# EAGLE design sound-detector (EAGLE 9.1.0)
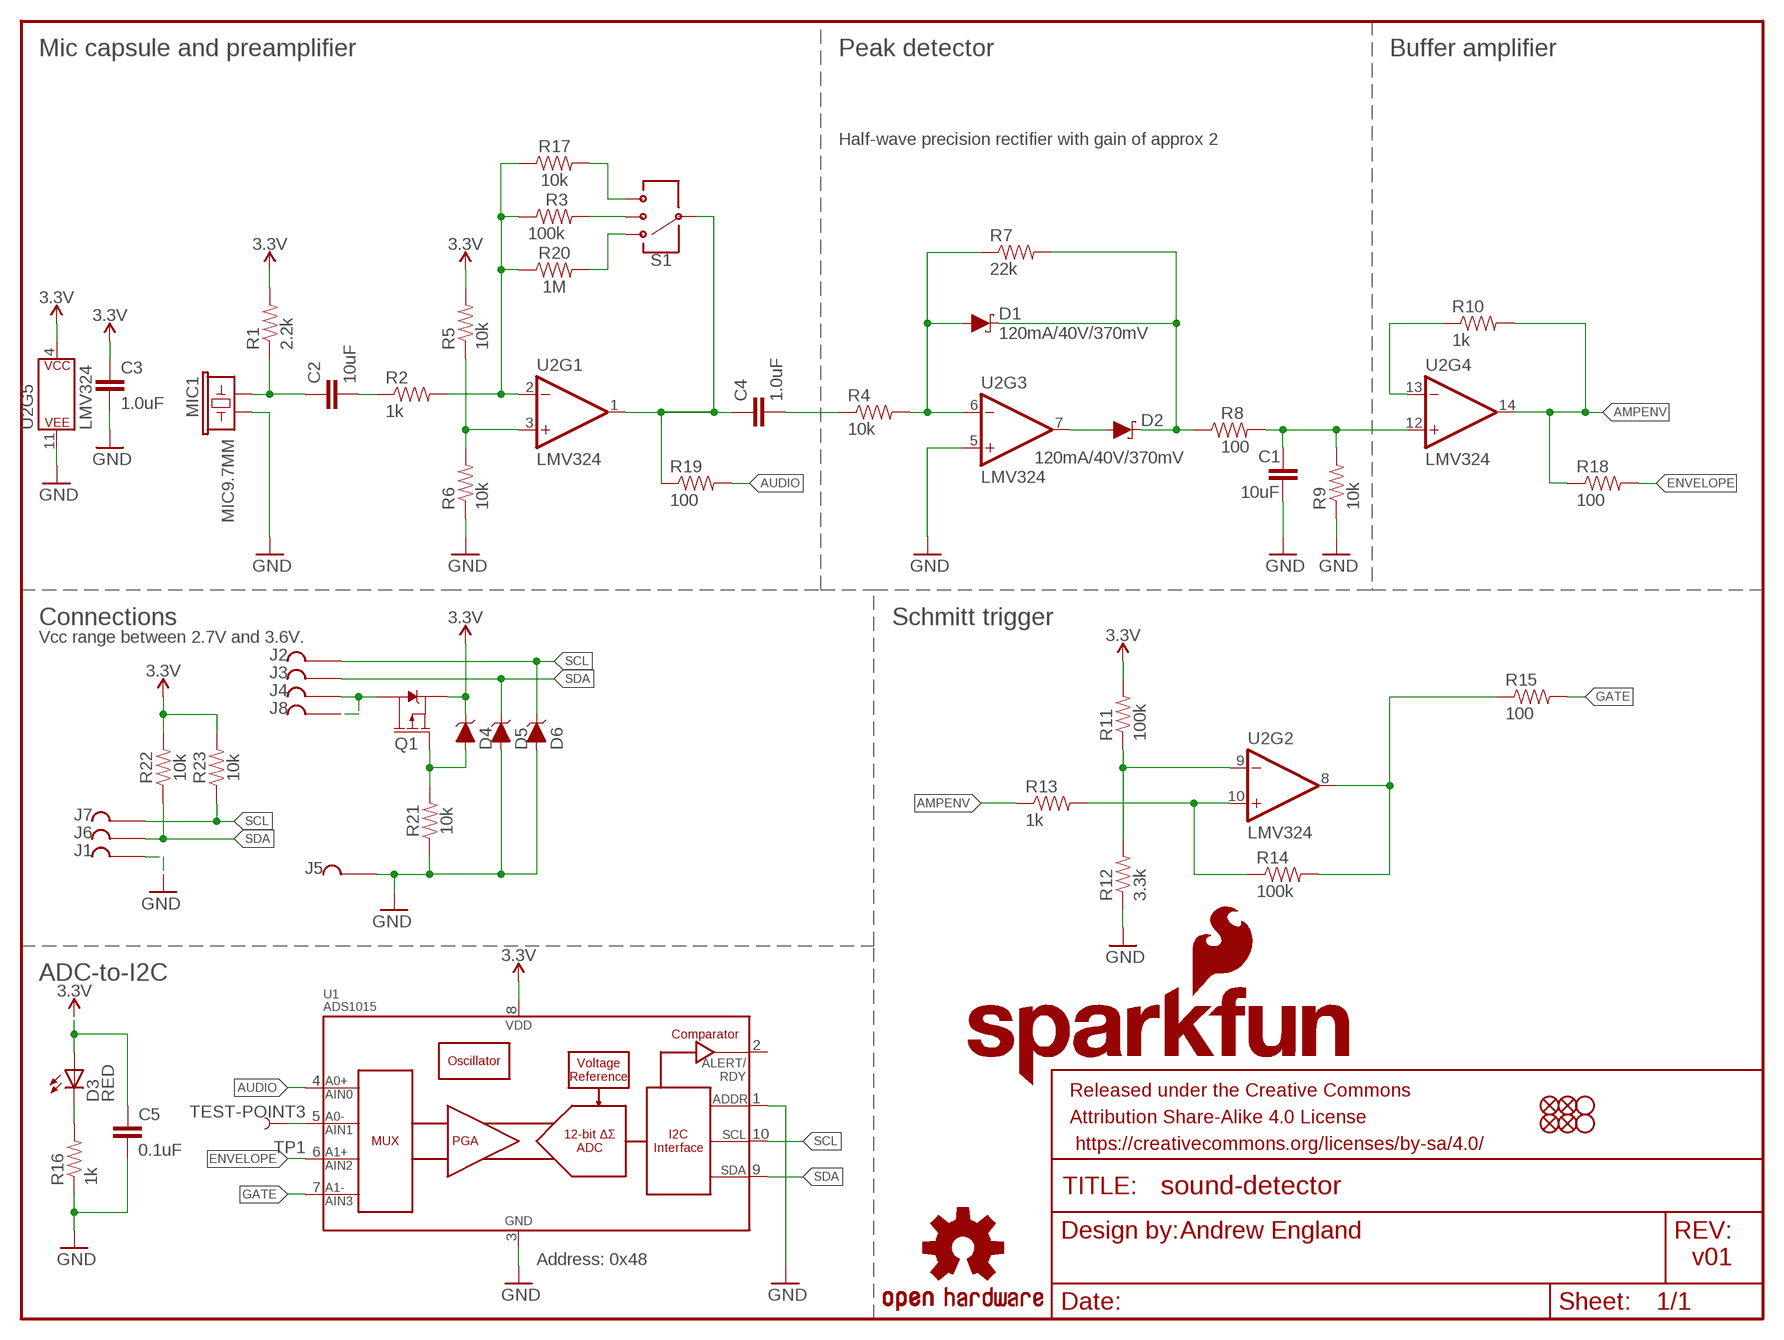
[diagram p0: schematic, sheet 1]

## Parts
C1  10uF  10UF-6.3V-20%(1206)  [1206@1]
C2  10uF  10UF-6.3V-20%(1206)  [1206@1]
C3  1.0uF  1.0UF-0603-16V-10%  [0603]
C4  1.0uF  1.0UF-0603-16V-10%  [0603]
C5  0.1uF  0.1UF-0603-25V-(+80/-20%)  [0603]
D1  120mA/40V/370mV  DIODE-SCHOTTKY-RB751S40  [SOD-523]
D2  120mA/40V/370mV  DIODE-SCHOTTKY-RB751S40  [SOD-523]
D3  RED  LED-RED0603  [LED-0603]
D4  3.6V  DIODE-ZENER-BZT52C3V6S  [SOD-323]
D5  3.6V  DIODE-ZENER-BZT52C3V6S  [SOD-323]
D6  3.6V  DIODE-ZENER-BZT52C3V6S  [SOD-323]
FID1  FIDUCIAL1X2  [FIDUCIAL-1X2]
FID2  FIDUCIAL1X2  [FIDUCIAL-1X2]
FID3  FIDUCIAL1X2  [FIDUCIAL-1X2]
FID4  FIDUCIAL1X2  [FIDUCIAL-1X2]
FRAME1  FRAME-LETTER  [CREATIVE_COMMONS]
H1  STAND-OFFTIGHT  [STAND-OFF-TIGHT]
H2  STAND-OFFTIGHT  [STAND-OFF-TIGHT]
J1  GATORGATOR_MINI  [GATOR_MINI]
J2  GATORGATOR_MINI  [GATOR_MINI]
J3  GATORGATOR_MINI  [GATOR_MINI]
J4  GATORGATOR_MINI  [GATOR_MINI]
J5  GATORGATOR_MINI  [GATOR_MINI]
J6  GATORGATOR_MINI  [GATOR_MINI]
J7  GATORGATOR_MINI  [GATOR_MINI]
J8  GATORGATOR_MINI  [GATOR_MINI]
LOGO1  OSHW-LOGOS  [OSHW-LOGO-S]
LOGO2  SFE_LOGO_NAME_FLAME.2_INCH  [SFE_LOGO_NAME_FLAME_.2]
LOGO3  SFE_LOGO_FLAME.2_INCH  [SFE_LOGO_FLAME_.2]
MIC1  MIC9.7MM  [MIC-9.7MM]
Q1  2.5A/30V/105mΩ  MOSFET_PCH-DMG2307L  [SOT23-3]
R1  2.2k  2.2KOHM-0603-1/10W-1%  [0603]
R2  1k  1KOHM-0603-1/10W-1%  [0603]
R3  100k  100KOHM-0603-1/10W-1%  [0603]
R4  10k  10KOHM-0603-1/10W-1%  [0603]
R5  10k  10KOHM-0603-1/10W-1%  [0603]
R6  10k  10KOHM-0603-1/10W-1%  [0603]
R7  22k  22KOHM-0603-1/10W-1%  [0603]
R8  100  100OHM-0603-1/10W-1%  [0603]
R9  10k  10KOHM-0603-1/10W-1%  [0603]
R10  1k  1KOHM-0603-1/10W-1%  [0603]
R11  100k  100KOHM-0603-1/10W-1%  [0603]
R12  3.3k  3.3KOHM-0603-1/10W-1%  [0603]
R13  1k  1KOHM-0603-1/10W-1%  [0603]
R14  100k  100KOHM-0603-1/10W-1%  [0603]
R15  100  100OHM-0603-1/10W-1%  [0603]
R16  1k  1KOHM-0603-1/10W-1%  [0603]
R17  10k  10KOHM-0603-1/10W-1%  [0603]
R18  100  100OHM-0603-1/10W-1%  [0603]
R19  100  100OHM-0603-1/10W-1%  [0603]
R20  1M  1MOHM-0603-1/4W-5%  [0603]
R21  10k  10KOHM-0603-1/10W-1%  [0603]
R22  10k  10KOHM-0603-1/10W-1%  [0603]
R23  10k  10KOHM-0603-1/10W-1%  [0603]
S1  SWITCH-SP3T-SMD  [SWITCH_SP3T_SMD]
TP1  TEST-POINT3  [PAD.03X.03]
U1  ADS1015  [MSOP10]
U2  LMV324  [SO14]

## Nets
3.3V: C3.1 C5.1 D3.A D4.C Q1.2(S) R1.2 R5.2 R11.2 R22.2 R23.2 U1.8(VDD) U2.4(P$V+)
AMPENV: R10.2 R13.1 R18.1 U2.14(OUT)
AUDIO: R19.2 U1.4(AIN0)
ENVELOPE: R18.2 U1.6(AIN2)
GATE: R15.2 U1.7(AIN3)
GND: C1.2 C3.2 C5.2 D5.A D6.A J1.P$2 J5.P$2 MIC1.2 R6.1 R9.1 R12.1 R16.1 R21.1 U1.1(ADDR) U1.3(VSS) U2.5(+IN) U2.11(P$V-)
N$: C4.1 R19.1 S1.3 U2.1(OUT)
N$1: C2.1 MIC1.1 R1.1
N$2: R5.1 R6.2 U2.3(+IN)
N$3: D3.C R16.2
N$4: R2.2 R3.1 R17.1 R20.1 U2.2(-IN)
N$5: C2.2 R2.1
N$6: C4.2 R4.1
N$7: D1.A R4.2 R7.1 U2.6(-IN)
N$8: D2.A U2.7(OUT)
N$9: D1.C D2.C R7.2 R8.1
N$10: C1.1 R8.2 R9.2 U2.12(+IN)
N$11: R10.1 U2.13(-IN)
N$12: TP1.P$1 U1.5(AIN1)
N$13: R17.2 S1.4
N$14: R3.2 S1.2
N$15: R11.1 R12.2 U2.9(-IN)
N$16: R13.2 R14.1 U2.10(+IN)
N$17: R14.2 R15.1 U2.8(OUT)
N$18: R20.2 S1.1
N$19: J4.P$2 J8.P$2 Q1.3(D)
N$20: D4.A Q1.1(G) R21.2
SCL: D6.C J2.P$2 J7.P$2 R23.1 U1.10(SCL)
SDA: D5.C J3.P$2 J6.P$2 R22.1 U1.9(SDA)
Unconnected: U1.2(ALERT/RDY)

## Notes on the sheet
- Mic capsule and preamplifier | Peak detector | Buffer amplifier
- Half-wave precision rectifier with gain of approx 2
- Connections | Schmitt trigger
- Vcc range between 2.7V and 3.6V.
- ADC-to-I2C
- Andrew England
- Address: 0x48 | v01

## Library data of the parts
C1 C2 = SparkFun-Capacitors:10UF-6.3V-20%(1206): Ceramic CAP-10057; PROD_ID: CAP-10057
C3 C4 = SparkFun-Capacitors:1.0UF: 1µF ceramic capacitors A capacitor is a passive two-terminal electrical component used to store electrical energy temporarily in an electric field.; PROD_ID: CAP-00868
C5 = SparkFun-Capacitors:0.1UF: 0.1µF ceramic capacitors A capacitor is a passive two-terminal electrical component used to store electrical energy temporarily in an electric field.; PROD_ID: CAP-00810
D1 D2 = SparkFun-DiscreteSemi:DIODE-SCHOTTKY: Schottky diode A Schottky diode is a semiconductor diode which has a low forward voltage drop and a very fast switching action.; PROD_ID: DIO-11018
D3 = SparkFun-LED:LED-RED: Assorted Red LEDs LilyPad 1206- DIO-09912 1206- DIO-00809 0603- DIO-00819; PROD_ID: DIO-00819
D4-D6 = SparkFun-DiscreteSemi:DIODE-ZENER: Zener Diode A Zener diode allows current to flow from its anode to its cathode like a normal semiconductor diode, but it also permits current to flow in the reverse direction when its "Zener voltage" is reached. - WIkipedia; PROD_ID: DIO-08199
FID1-FID4 = SparkFun-Aesthetics:FIDUCIAL: Fiducial Alignment Points Point-of-reference for pick-and-place machines and other optical instruments.
FRAME1 = SparkFun-Aesthetics:FRAME-LETTER: Schematic Frame - Letter Standard 8.5x11 US Letter frame
H1 H2 = SparkFun-Hardware:STAND-OFF: Stand Off Drill holes for mechanically mounting via screws, standoffs, etc. Note: Use the keepout ring to avoid running the screw head into surrounding components. Variant Overviews STAND-OFF - Mechanical footprint for a #4 phillips button head screw. STAND-OFF-TIGHT - Mechanical footprint for a #4 phillips button head screw, Example SparkFun Products Screw - Phillips Head (1/4", 4-40, 10 pack) <https://www.sparkfun.com/products/10453> (PRT-10453) Screw - Phillips Head (1/2", 4-40, 10 pack) <https://www.sparkfun.com/products/10452> (PRT-10452) Screw - Phillips Head (3/4", 4-40, 10 pack) <https://www.sparkfun.com/products/10451> (PRT-10451) Screw - Phillips Head (1", 4-40, 10 pack) <https://www.sparkfun.com/products/10450> (PRT-10450)
J1-J8 = SparkFun-Connectors:GATOR
LOGO1 = SparkFun-Aesthetics:OSHW-LOGO: Open-Source Hardware (OSHW) Logo This logo indicates the piece of hardware it is found on incorporates a OSHW license and/or adheres to the definition of open source hardware found here: http://freedomdefined.org/OSHW
LOGO2 = SparkFun-Aesthetics:SFE_LOGO_NAME_FLAME: SparkFun Font Logo w/ Flame This is the SparkFun full logo. The logo on the schematic will always be the same size; the package variant is the height of the flame part of the logo. Default layer for the logo on the board is tSilk.
LOGO3 = SparkFun-Aesthetics:SFE_LOGO_FLAME: SparkFun Flame Logo This is the SparkFun flame logo. The logo on the schematic will always be the same size; the package variant is the height of the flame. Default layer for the logo on the board is tSilk.
MIC1 = SparkFun-Sensors:MIC: Omni-directional electret microphone. 9.7mm standard diameter.; PROD_ID: COMP-08856
Q1 = SparkFun-DiscreteSemi:MOSFET_PCH: P-channel MOSFETs Voltage controlled devices that allow control of high current outputs. SparkFun Products: SparkFun ESP32 Thing <https://www.sparkfun.com/products/13907> SparkFun ESP8266 Thing <https://www.sparkfun.com/products/13231>; PROD_ID: TRANS-11308
R1 = SparkFun-Resistors:2.2KOHM: 2.2kΩ resistor A resistor is a passive two-terminal electrical component that implements electrical resistance as a circuit element. Resistors act to reduce current flow, and, at the same time, act to lower voltage levels within circuits. - Wikipedia; PROD_ID: RES-08272
R2 R10 R13 R16 = SparkFun-Resistors:1KOHM: 1kΩ resistor A resistor is a passive two-terminal electrical component that implements electrical resistance as a circuit element. Resistors act to reduce current flow, and, at the same time, act to lower voltage levels within circuits. - Wikipedia; PROD_ID: RES-07856
R3 R11 R14 = SparkFun-Resistors:100KOHM: 100kΩ resistor A resistor is a passive two-terminal electrical component that implements electrical resistance as a circuit element. Resistors act to reduce current flow, and, at the same time, act to lower voltage levels within circuits. - Wikipedia; PROD_ID: RES-07828
R4-R6 R9 R17 R21-R23 = SparkFun-Resistors:10KOHM: 10kΩ resistor A resistor is a passive two-terminal electrical component that implements electrical resistance as a circuit element. Resistors act to reduce current flow, and, at the same time, act to lower voltage levels within circuits. - Wikipedia; PROD_ID: RES-00824
R7 = SparkFun-Resistors:22KOHM: 22kΩ resistor A resistor is a passive two-terminal electrical component that implements electrical resistance as a circuit element. Resistors act to reduce current flow, and, at the same time, act to lower voltage levels within circuits. - Wikipedia; PROD_ID: RES-07853
R8 R15 R18 R19 = SparkFun-Resistors:100OHM: 100Ω resistor A resistor is a passive two-terminal electrical component that implements electrical resistance as a circuit element. Resistors act to reduce current flow, and, at the same time, act to lower voltage levels within circuits. - Wikipedia; PROD_ID: RES-07863
R12 = SparkFun-Resistors:3.3KOHM: 3.3kΩ resistor A resistor is a passive two-terminal electrical component that implements electrical resistance as a circuit element. Resistors act to reduce current flow, and, at the same time, act to lower voltage levels within circuits. - Wikipedia; PROD_ID: RES-07851
R20 = SparkFun-Resistors:1MOHM: 1MΩ resistor A resistor is a passive two-terminal electrical component that implements electrical resistance as a circuit element. Resistors act to reduce current flow, and, at the same time, act to lower voltage levels within circuits. - Wikipedia; PROD_ID: RES-07868
S1 = SparkFun-Switches:SWITCH-SP3T: Single-Pole, Triple-Throw (SP3T) Switch Single-Pole, Triple-Throw switches SparkFun Products Prototype Part; PROD_ID: SWCH-10805
TP1 = SparkFun-Connectors:TEST-POINT: SparkFun Test Points Bare copper test points for troubleshooting or In-Circuit-Testing. These are used by our Production team for verifying production board runs using pogo-pins on test beds. SparkFun Products: SparkFun LSM9DS1 Breakout <https://www.sparkfun.com/products/13284> SparkFun PSOC <https://www.sparkfun.com/products/13714> SparkFun Load Cell Amplifier <https://www.sparkfun.com/products/13879>
U1 = SparkFun-IC-Conversion:ADS1015: ADS1015 12-BIT ADC 12-Bit Del-Sig ADC Four single-ended inputs or two differential inputs Internal PGA I2C interface 2.0-5.5V SparkFun Products SparkFun Block for Intel Edison - ADC <https://www.sparkfun.com/products/13770> (DEV-13770); PROD_ID: IC-12270
U2 = SparkFun-IC-Amplifiers:LMV324: IC LMV324 Quad Op Amp Jellybean quad op-amp Datasheet <http://cdn.sparkfun.com/datasheets/Sensors/Sound/LMV324.pdf> SparkFun Products SparkFun Sensor Kit <https://www.sparkfun.com/products/13754> (DEV-13754) SparkFun Inventor's Kit for Arduino 101 <https://www.sparkfun.com/products/13844> (KIT-13844) SparkFun Sound Detector <https://www.sparkfun.com/products/12642> (SEN-12642); PROD_ID: IC-08227

## Board
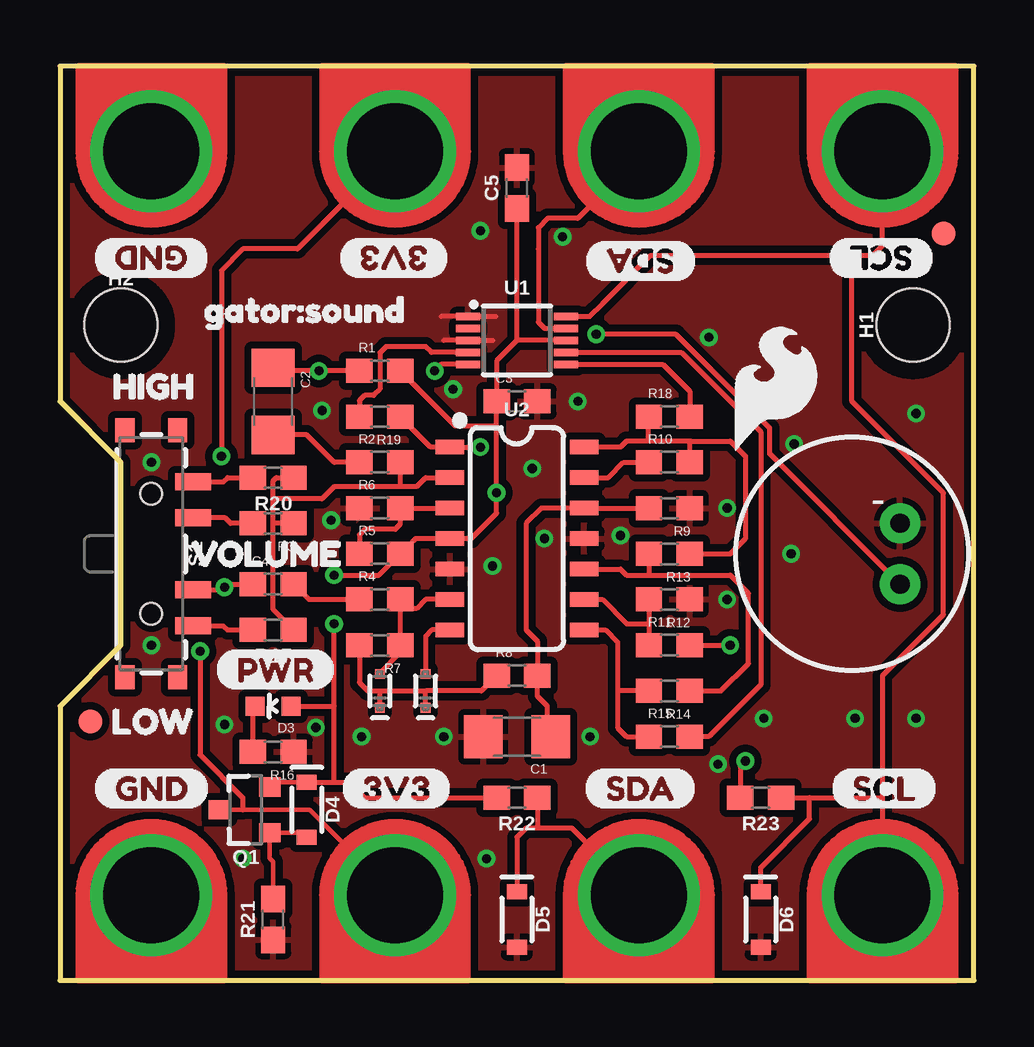
[diagram p1: board, top side]
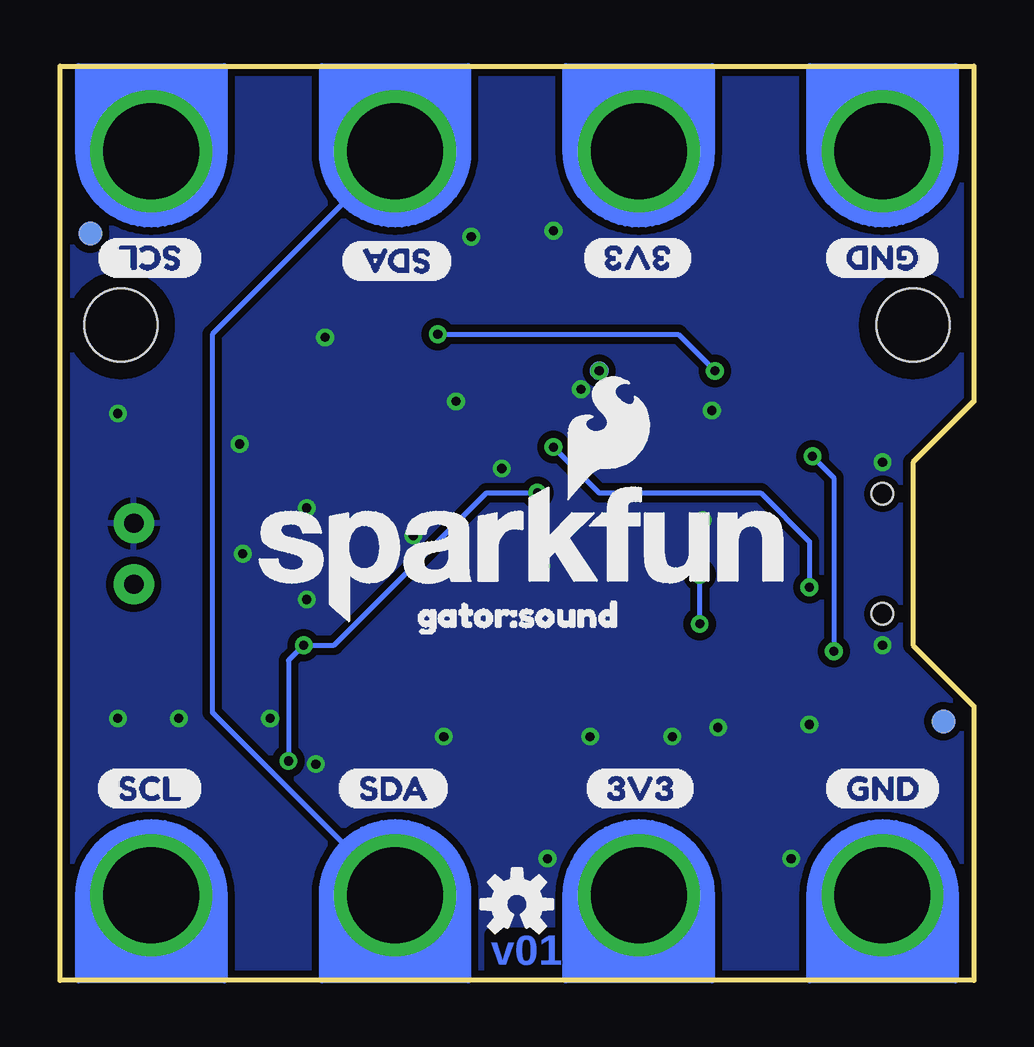
[diagram p2: board, bottom side, seen from below]

Size 38.1 x 38.1 mm. Coordinates in mm from the lower left corner, seen from the top.
Outline: 0,0 38.1,0 38.1,38.1 0,38.1 0,24.13 2.54,21.59 2.54,13.97 0,11.43 0,0
Copper layers (1*16): Top 0.035mm / dielectric 1.5mm / Bottom 0.035mm
Design rules "SparkFun-2-layer-TIGHT": minimum track width 7mil, minimum drill 15mil, track to track 7mil, track to pad 7mil, pad to pad 7mil, via to via 7mil, smd to smd 7mil, copper to edge 7mil, drill to drill 7mil, minimum pad ring 7mil, minimum via ring 7mil, stop-mask expansion 4mil, vias tented up to drill 25mil, thermal gap 10mil

### Footprints (pad centres in the part's own frame; a part is rotated, then mirrored left to right if it is on the bottom)
1206@1 = smd 1.6 x 1.8: 1 -1.4,0; 2 1.4,0
0603 = smd 1.1 x 1: 1 -0.85,0; 2 0.85,0
SOD-523 = smd 0.4 x 0.4: A -0.7,0; C 0.7,0
LED-0603 = smd 0.8 x 0.8: A 0,-0.75; C 0,0.75
SOD-323 = smd 0.63 x 0.83: A 1.15,0; C -1.15,0
FIDUCIAL-1X2 = smd 1 x 1: 1 0,0
STAND-OFF-TIGHT = hole 3.048: 0,0
GATOR_MINI = drill 4 pad 5.08: P$2 0,-0.254
MIC-9.7MM = drill 0.8 pad 1.676: 1 -2,1.27; 2 -2,-1.27
SOT23-3 = smd 0.8 x 0.9: 1 -0.95,-1; 2 0.95,-1; 3 0,1.1
SWITCH_SP3T_SMD = smd 0.7 x 1.5: 1 3,-1.75; 2 1.5,-1.75; 3 -1.5,-1.75; 4 -3,-1.75 | smd 1 x 0.8: P$1 -5.15,-1.1; P$2 -5.15,1.1; P$3 5.15,1.1; P$4 5.15,-1.1 | hole 0.9: 2.5,0; -2.5,0
PAD.03X.03 = smd 0.762 x 0.762: P$1 0,0
MSOP10 = smd 0.3 x 1: 1 -1,-2.05; 2 -0.5,-2.05; 3 0,-2.05; 4 0.5,-2.05; 5 1,-2.05; 6 1,2.05; 7 0.5,2.05; 8 0,2.05; 9 -0.5,2.05; 10 -1,2.05
SO14 = smd 0.6 x 1.2: 1 -3.175,-2.8; 2 -1.905,-2.8; 3 -0.635,-2.8; 4 0.635,-2.8; 5 1.905,-2.8; 6 3.175,-2.8; 7 4.445,-2.8; 8 4.445,2.8; 9 3.175,2.8; 10 1.905,2.8; 11 0.635,2.8; 12 -0.635,2.8; 13 -1.905,2.8; 14 -3.175,2.8

### Placement (x,y rotation side)
C1  19.05,10.16 180 top
C2  8.89,24.13 270 top
C3  19.05,24.13 0 top
C4  8.89,16.51 0 top
C5  19.05,33.02 90 top
D1  13.34,12.06 270 top
D2  15.24,12.06 270 top
D3  8.89,11.43 90 top
D4  10.29,7.11 270 top
D5  19.05,2.54 270 top
D6  29.21,2.54 270 top
FID1  1.27,10.79 0 bottom
FID2  36.83,31.11 0 bottom
FID3  1.27,10.79 0 top
FID4  36.83,31.11 0 top
FRAME1  1.27,-10.16 0 top  (outside the outline)
H1  35.56,27.3 90 top
H2  2.54,27.3 0 top
J1  3.81,34.29 180 top
J2  34.29,3.81 0 top
J3  24.13,3.81 0 top
J4  13.97,3.81 0 top
J5  3.81,3.81 0 top
J6  24.13,34.29 180 top
J7  34.29,34.29 180 top
J8  13.97,34.29 180 top
LOGO1  19.05,3.17 0 bottom
LOGO2  18.8,17.78 0 bottom
LOGO3  29.84,24.64 0 top
MIC1  33.02,17.78 180 top
Q1  7.75,7.11 90 top
R1  13.34,25.4 0 top
R2  13.34,21.59 0 top
R3  8.89,19.05 180 top
R4  13.34,15.88 0 top
R5  13.34,17.78 0 top
R6  13.34,19.68 0 top
R7  13.34,13.97 180 top
R8  19.05,12.7 0 top
R9  25.4,19.68 180 top
R10  25.4,21.59 0 top
R11  25.4,13.97 0 top
R12  25.4,15.88 180 top
R13  25.4,17.78 180 top
R14  25.4,12.06 180 top
R15  25.4,10.16 0 top
R16  8.89,9.53 180 top
R17  8.89,14.61 180 top
R18  25.4,23.5 0 top
R19  13.34,23.5 180 top
R20  8.89,20.95 180 top
R21  8.89,2.54 90 top
R22  19.05,7.62 180 top
R23  29.21,7.62 180 top
S1  3.81,17.78 90 top
TP1  15.62,25.4 0 bottom
U1  19.05,26.67 270 top
U2  19.05,19.05 270 top
U$1  [3V31]  11.68,8 0 top
U$2  [SCL1]  32.13,8 0 top
U$3  [SDA2]  21.84,8 0 top
U$4  [PWR0]  6.48,12.95 0 top
U$5  [GND0]  1.4,8 0 top
U$6  [GND0]  6.22,8 0 bottom
U$7  [3V31]  16.26,8 0 bottom
U$8  [SDA2]  26.54,8 0 bottom
U$9  [SCL1]  36.58,8 0 bottom
U$10  [GND0]  6.22,30.1 180 top
U$11  [3V31]  16.26,30.1 180 top
U$12  [SDA2]  26.54,29.97 180 top
U$13  [SCL1]  36.45,30.1 180 top
U$14  [GATOR#SOUND1]  24.13,15.24 0 bottom
U$15  [LOW1]  1.27,10.79 0 top
U$16  [VOLUME2]  4.57,17.78 0 top
U$17  [GND0]  1.4,30.1 180 bottom
U$18  [3V31]  11.68,30.1 180 bottom
U$19  [SDA2]  21.72,29.97 180 bottom
U$20  [SCL1]  32.13,30.1 180 bottom
U$21  [HIGH0]  1.27,24.77 0 top
U$22  [ORDERING_INSTRUCTIONS]  -5.08,-15.24 0 top  (outside the outline)
U$23  [GATOR#SOUND1]  5.08,27.94 0 top

### Tracks (layer width: path | path; a pad name or v marks a point on that pad's centre or on a via)
3.3V  (via drill 0.38)
  Top 0.178: Q1.2 8.95,8.26 D4.C | 14.82,18.41 14.71,18.31 R5.2
  Top 0.203: D4.C 11.43,8.26 | 11.43,8.26 12.06,8.26 12.7,7.62 R22.2 | 11.43,8.26 11.43,11.43 | 11.43,11.43 v11.43,14.86 | v11.43,16.89 13.3,16.89 R5.2 | D3.A 11.43,11.43 | 18.2,23.11 v18.2,20.32 18.2,19.47 17.14,18.41 U2.4 14.82,18.41 14.71,18.31 | 18.2,23.11 C3.1 18.2,25.82 19.05,26.67 | U1.8 19.05,26.67 | R1.2 16.47,23.11 18.2,23.11 | R11.2 v27.94,13.97 | v28.57,9.14 28.36,8.93 R23.2 | 19.05,26.67 C5.1
  Bottom 0.203: v11.43,14.86 v11.43,16.89 | v18.2,20.32 20.32,20.32 26.67,13.97 v27.94,13.97 28.57,13.34 v28.57,9.14
AMPENV
  Top 0.203: 26.29,22.48 24.51,22.48 | 24.51,22.48 23.62,22.48 23.37,22.23 U2.14 | R18.1 24.51,23.46 24.51,22.48 | R13.1 27.94,17.78 28.57,18.41 28.57,21.84 27.94,22.48 26.29,22.48 | 26.29,22.48 26.25,22.44 R10.2
AUDIO
  Top 0.203: U1.4 16.51,26.17 15.49,26.17 15.24,26.42 13.59,26.42 | 13.59,26.42 13.34,26.16 | 13.59,26.42 13.34,26.16 | 13.34,26.16 13.34,24.64 13.08,24.38 12.7,24.38 12.48,24.17 R19.2
ENVELOPE
  Top 0.203: U1.6 25.13,25.67 26.25,24.55 R18.2
GATE
  Top 0.203: U1.7 25.9,26.17 29.21,22.86 29.21,12.32 27.05,10.16 R15.2
GND  (via drill 0.38)
  Top 0.203: 16,26.67 U1.3 18.03,26.67 | 15.89,27.67 U1.1 18.18,27.67
  other vias: 11.3,19.18 18.03,17.27 20.19,18.41 16,10.16 22.1,10.16 27.81,19.68 27.81,15.88 10.67,10.54 30.48,17.78 17.78,5.08 3.81,13.97 3.81,21.59 21.59,24.13 17.53,31.24 20.95,30.99 27.05,26.8 19.68,21.34 30.61,22.35 29.34,10.92 33.15,10.92 35.69,10.92 35.69,23.62 16.38,24.64 10.92,23.75 6.86,10.67 12.57,10.16 23.37,18.54 27.43,9.02 7.62,5.08
  pour Bottom (isolate 0.305): 0,0 0,38.1 38.1,38.1 38.1,0
  pour Top (isolate 0.305): 0,0 0,38.1 38.1,38.1 38.1,0
N$  (via drill 0.38)
  Top 0.203: R19.1 15.46,22.23 U2.1 v17.53,22.23 | S1.3 6.75,16.28 v6.86,16.38 6.99,16.51 C4.1
  Bottom 0.203: v17.53,22.23 15.62,20.32 8.89,20.32 6.86,18.29 v6.86,16.38
N$1  (via drill 0.38)
  Top 0.203: R1.1 v10.79,25.4 9.02,25.4 C2.1 | MIC1.1 29.59,21.94 29.59,23.02 25.68,26.92 v22.35,26.92
  Bottom 0.203: v22.35,26.92 12.32,26.92 v10.79,25.4
N$2
  Top 0.203: R5.1 12.48,18.58 12.7,18.8 13.97,18.8 14.19,19.01 R6.2 U2.3
N$3
  Top 0.203: D3.C 8.04,11.33 R16.2
N$4
  Top 0.203: 14.22,20.57 14.86,20.57 15.24,20.95 U2.2 | 14.22,20.57 11.43,20.57 10.92,20.07 8.89,20.07 | R17.1 8.89,15.46 8.89,19.05 | R20.1 9.02,20.95 8.89,20.83 8.89,20.07 | 8.89,19.05 8.89,20.07 | R3.1 8.89,19.05 | R2.2 14.19,20.61 14.22,20.57
N$5
  Top 0.203: R2.1 11.43,21.59 10.29,22.73 C2.2
N$6
  Top 0.203: R4.1 10.38,15.88 C4.2
N$7
  Top 0.203: R4.2 14.19,15.49 | 14.19,15.49 R7.1 14.19,13.68 13.34,12.83 D1.A | 14.19,15.49 14.86,15.49 15.24,15.88 U2.6
N$8
  Top 0.203: D2.A 15.24,14.35 15.49,14.61 U2.7
N$9
  Top 0.203: 15.24,12.06 17.57,12.06 R8.1 | D2.C 15.24,12.06 | R7.2 12.48,12.41 12.83,12.06 13.34,12.06 | 13.34,12.06 15.24,12.06 | D1.C 13.34,12.06
N$10
  Top 0.203: C1.1 20.32,10.29 20.32,11.43 19.9,11.85 R8.2 19.9,14.14 19.43,14.61 19.43,19.05 20.07,19.68 U2.12 R9.2
N$11
  Top 0.203: R10.1 23.5,21.59 22.86,20.95 U2.13
N$12  (via drill 0.38)
  Top 0.203: U1.5 15.89,25.67 TP1.P$1
  other vias: 15.62,25.4
N$13
  Top 0.203: S1.4 6.81,14.78 6.99,14.61 R17.2
N$14
  Top 0.203: R3.2 7.11,19.05 6.88,19.28 S1.2
N$15
  Top 0.203: R12.2 24.55,14.86 | 24.55,14.86 R11.1 | 24.55,14.86 23.62,14.86 22.61,15.88 U2.9
N$16
  Top 0.203: 24.51,16.89 23.62,16.89 23.37,17.14 U2.10 | R13.2 24.55,16.93 24.51,16.89 | R14.1 27.56,12.06 28.7,13.21 28.7,16.13 27.94,16.89 24.51,16.89
N$17
  Top 0.203: R15.1 23.62,10.16 23.24,10.54 23.24,12.06 | 23.24,12.06 23.24,14.1 22.73,14.61 U2.8 | R14.2 23.24,12.06
N$18
  Top 0.203: S1.1 6.81,20.78 6.99,20.95 R20.2
N$19  (via drill 0.38)
  Top 0.178: J4.P$2 10.41,7.11 7.62,7.11 Q1.3
  Top 0.203: J8.P$2 9.91,30.48 7.62,30.48 6.73,29.59 v6.73,21.84 | 7.62,7.11 7.62,7.62 5.84,9.4 v5.84,13.72
  Bottom 0.203: v6.73,21.84 5.84,20.95 v5.84,13.72
N$20
  Top 0.178: D4.A 10.09,6.16 Q1.1 8.75,5.1 8.89,4.95 R21.2
SCL
  Top 0.203: 34.29,7.62 34.29,12.7 36.83,15.24 36.83,20.32 33.02,24.13 33.02,30.21 | 34.29,7.62 J2.P$2 | R23.1 31.24,7.62 | 31.24,7.62 34.29,7.62 | D6.C 29.21,4.7 31.24,6.73 31.24,7.62 | 33.02,30.21 33.89,30.21 34.29,30.61 J7.P$2 | U1.10 22.08,27.67 22.61,28.19 24.62,30.21 33.02,30.21
SDA
  Top 0.203: J6.P$2 24.13,34.29 21.59,31.75 20.32,31.75 19.94,31.37 19.94,30.48 19.94,27.43 20.2,27.17 U1.9 | J3.P$2 21.34,6.35 19.94,6.35 | D5.C 19.05,5.97 19.43,6.35 19.94,6.35 | R22.1 19.9,6.39 19.94,6.35
  Bottom 0.203: J6.P$2 31.75,26.92 31.75,11.18 J3.P$2

### Text on the board
Bottom: v01
Measures: Units in Inches
tDocu: Andy England | Black Gloss Soldermask